# Altium schematic sheet GPS&&lte2.SchDoc
size A2
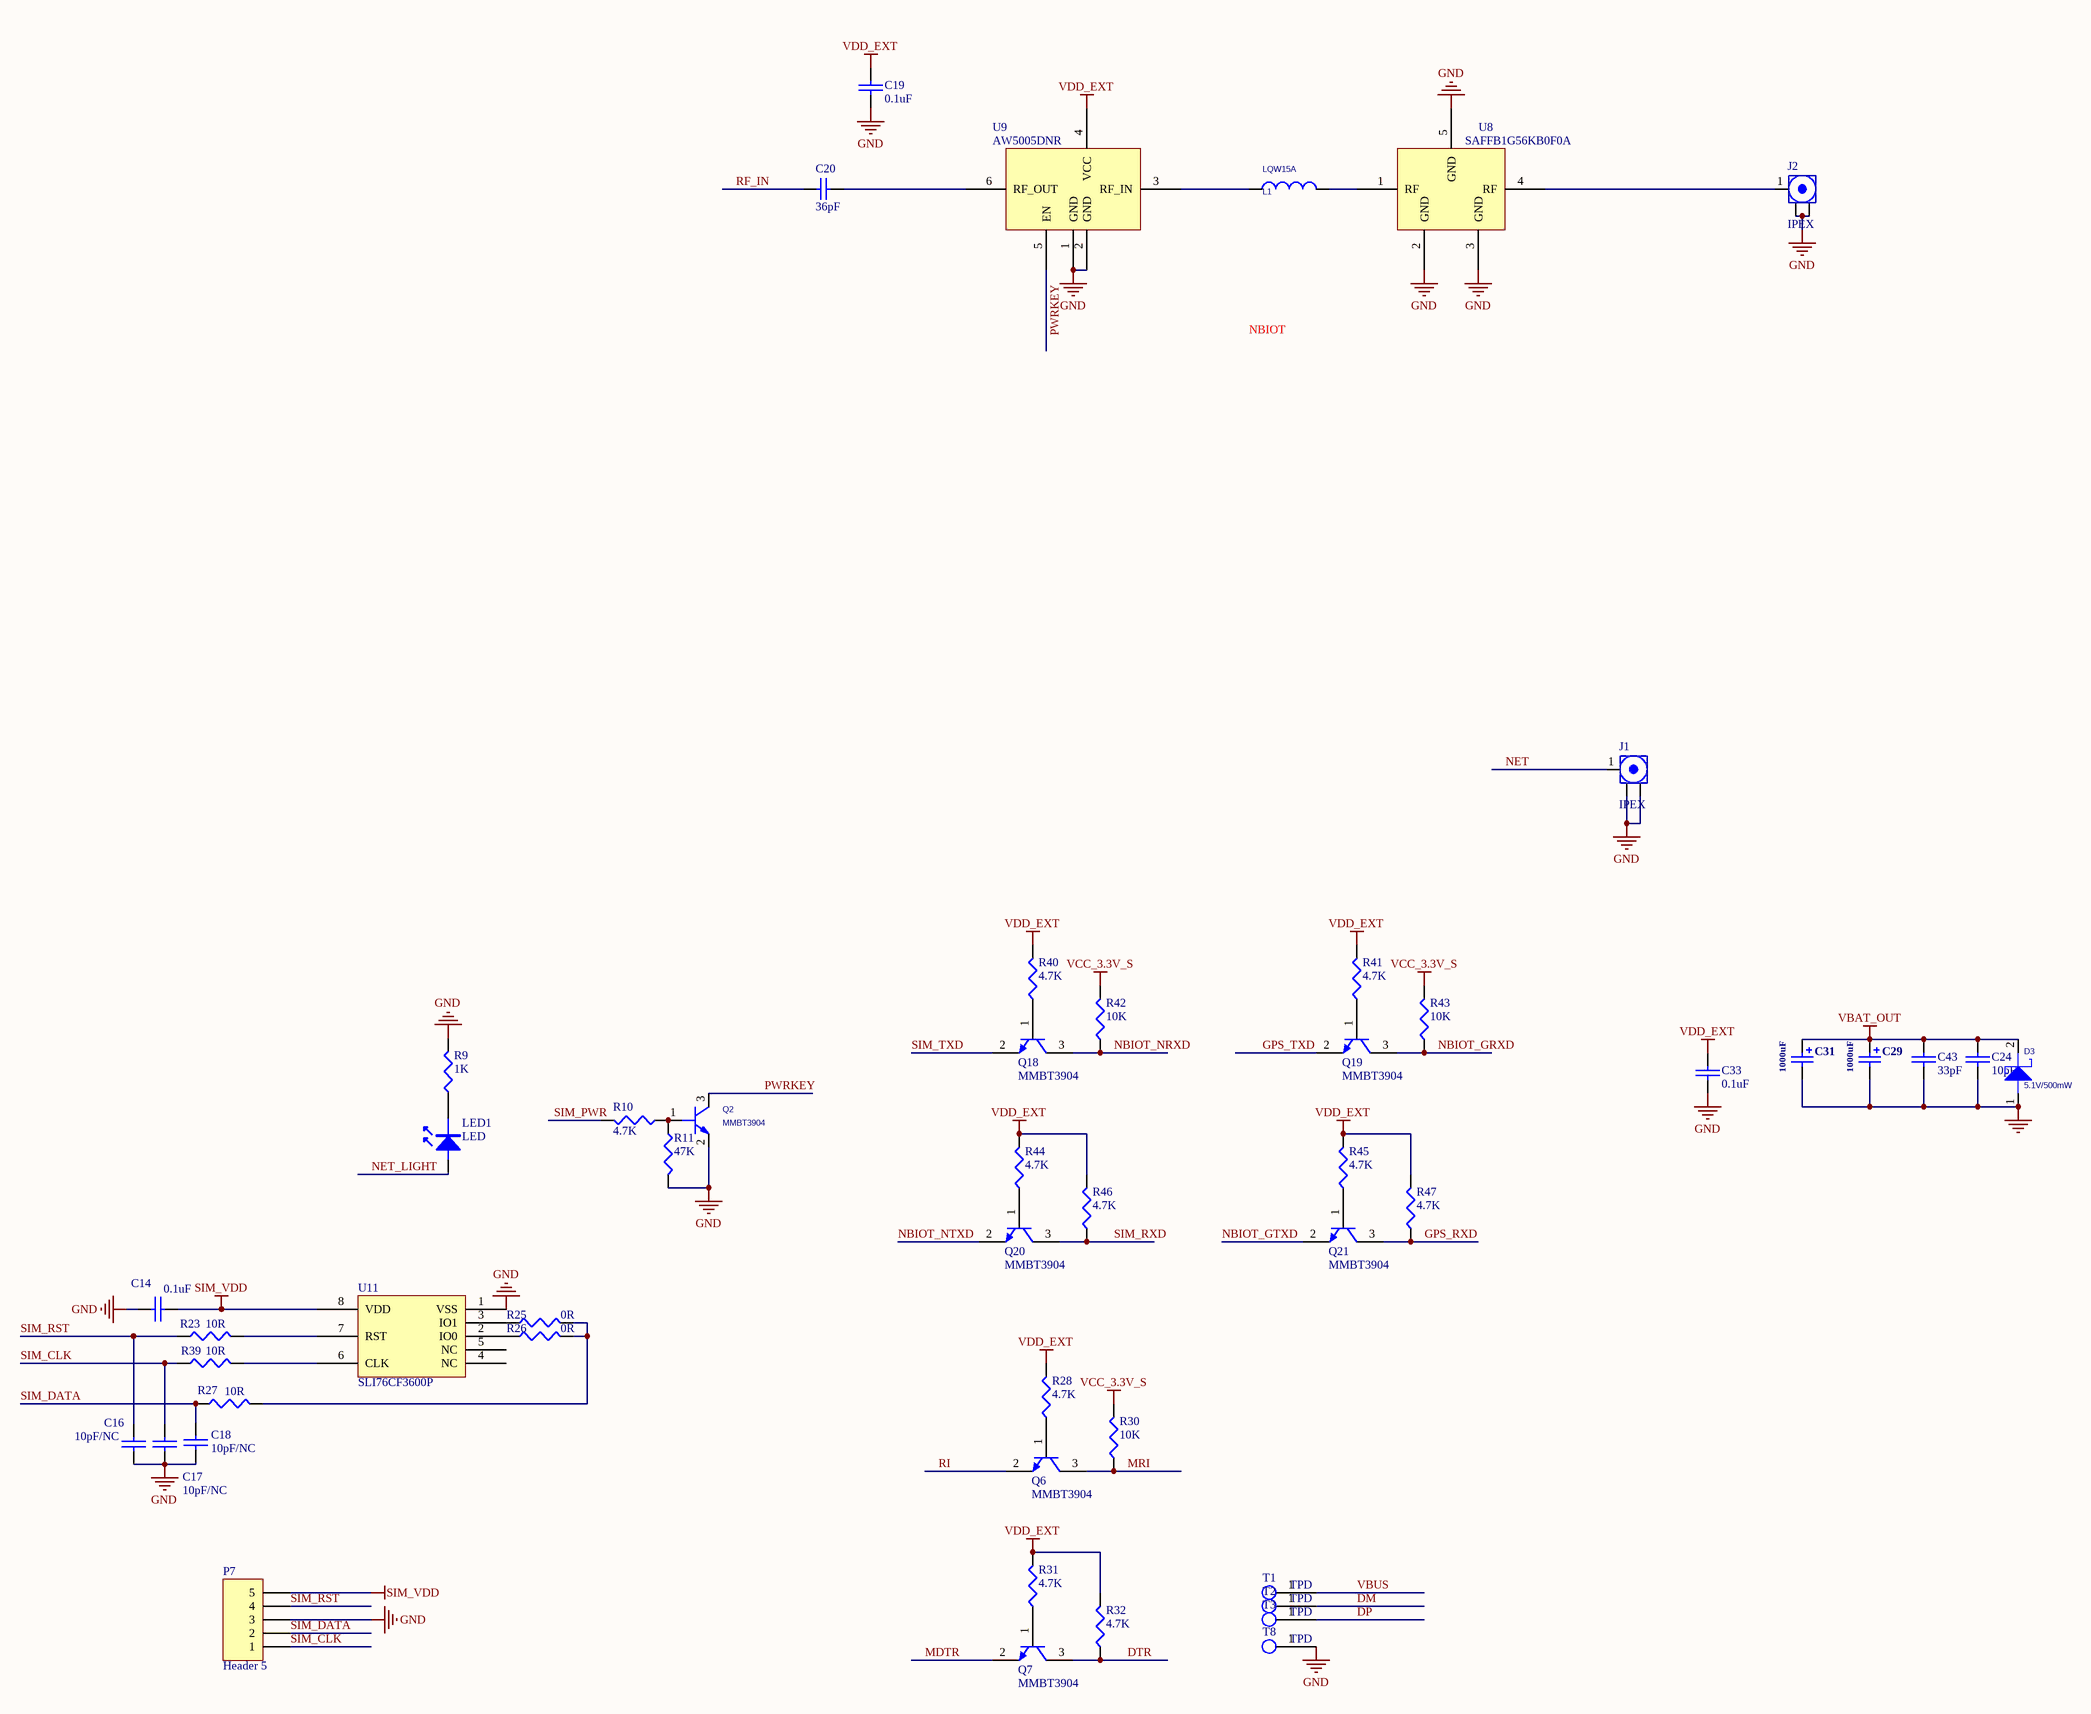
[diagram p0: GPS&&lte2.SchDoc]

## Parts
C14  0.1uF  [0402C]
C16  10pF/NC  [0402C]
C17  10pF/NC  [0402C]
C18  10pF/NC  [0402C]
C19  0.1uF  [0402C]
C20  36pF  [0402c]
C24  10pF  [0402C]
C29  1000uF  [7343]
C31  1000uF  [7343]
C33  0.1uF  [0402C]
C43  33pF  [0402C]
D3  value 5.1V/500mW  [LL-34(D1206)]  (hidden comment: DIODE_SCHOTTKY_0)
J1  IPEX  [RF-UFL]
J2  IPEX  [RF-UFL]
L1  LQW15A  [0402R]
LED1  LED  [0603LED]
P7  Header 5  [5×1.25mmSMT]
Q2  MMBT3904  [SOT23-3]
Q6  MMBT3904  [SOT23-3]
Q7  MMBT3904  [SOT23-3]
Q18  MMBT3904  [SOT23-3]
Q19  MMBT3904  [SOT23-3]
Q20  MMBT3904  [SOT23-3]
Q21  MMBT3904  [SOT23-3]
R9  1K  [0402R]
R10  4.7K  [0402R]
R11  47K  [0402R]
R23  10R  [0402R]
R25  0R  [0402R]
R26  0R  [0402R]
R27  10R  [0402R]
R28  4.7K  [0402R]
R30  10K  [0402R]
R31  4.7K  [0402R]
R32  4.7K  [0402R]
R39  10R  [0402R]
R40  4.7K  [0402R]
R41  4.7K  [0402R]
R42  10K  [0402R]
R43  10K  [0402R]
R44  4.7K  [0402R]
R45  4.7K  [0402R]
R46  4.7K  [0402R]
R47  4.7K  [0402R]
T1  TPD  [TPD]
T2  TPD  [TPD]
T3  TPD  [TPD]
T8  TPD  [TPD]
U8  SAFFB1G56KB0F0A  [SAFFB1G56KB0F0A]
U9  AW5005DNR  [AW5005]
U11  SLI76CF3600P  [QFN127P500X600X80-8N]

## Nets
GND: C14.1 C16.1 C17.1 C18.1 C19.1 C24.1 C29.2 C31.2 C33.1 C43.1 D3.1 J1.2(Y) J2.2(Y) P7.3 Q2.2(E) R9.2 R11.2 T8.1 U8.2(GND) U8.3(GND) U8.5(GND) U9.1(GND) U9.2(GND) U11.1(VSS)
SIM_VDD: C14.2 P7.5 U11.8(VDD)
VBAT_OUT: C24.2 C29.1 C31.1 C43.2 D3.2
VCC_3.3V_S: R30.2 R42.2 R43.2
VDD_EXT: C19.2 C33.2 R28.2 R31.2 R32.2 R40.2 R41.2 R44.2 R45.2 R46.2 R47.2 U9.4(VCC)
DM: T2.1
DP: T3.1
DTR: Q7.3(C) R32.1
GPS_RXD: Q21.3(C) R47.1
GPS_TXD: Q19.2(E)
MDTR: Q7.2(E)
MRI: Q6.3(C) R30.1
NBIOT_GRXD: Q19.3(C) R43.1
NBIOT_GTXD: Q21.2(E)
NBIOT_NRXD: Q18.3(C) R42.1
NBIOT_NTXD: Q20.2(E)
NET: J1.1(X)
NET_LIGHT: LED1.1
PWRKEY: Q2.3(C) U9.5(EN)
RF_IN: C20.1
RI: Q6.2(E)
SIM_CLK: C17.2 P7.1 R39.1
SIM_DATA: C18.2 P7.2 R27.1
SIM_PWR: R10.2
SIM_RST: C16.2 P7.4 R23.1
SIM_RXD: Q20.3(C) R46.1
SIM_TXD: Q18.2(E)
VBUS: T1.1
NetC20_2: C20.2 U9.6(RF_OUT)
NetJ2_1: J2.1(X) U8.4(RF)
NetL1_1: L1.1 U9.3(RF_IN)
NetL1_2: L1.2 U8.1(RF)
NetLED1_2: LED1.2 R9.1
NetQ2_1: Q2.1(B) R10.1 R11.1
NetQ6_1: Q6.1(B) R28.1
NetQ7_1: Q7.1(B) R31.1
NetQ18_1: Q18.1(B) R40.1
NetQ19_1: Q19.1(B) R41.1
NetQ20_1: Q20.1(B) R44.1
NetQ21_1: Q21.1(B) R45.1
NetR23_2: R23.2 U11.7(RST)
NetR25_1: R25.1 U11.3(IO1)
NetR25_2: R25.2 R26.2 R27.2
NetR26_1: R26.1 U11.2(IO0)
NetR39_2: R39.2 U11.6(CLK)

Not connected (* = marked no-connect by the designer): U11 4(NC) 5(NC)

## Notes on the sheet
- NBIOT

## Library data of the parts
C14 C16-C19 C24 C33 C43 = CAP: Capacitor
C20 = Cap: Capacitor; Value: 0.1uF/10V; Published: 8-Jun-2000; LatestRevisionDate: 17-Jul-2002; LatestRevisionNote: Re-released for DXP Platform.; PackageReference: RAD-0.3; Publisher: Altium Limited
C29 C31 = Cap Pol3: Polarized Capacitor (Surface Mount); PackageReference: C10*10.2
D3 = DIODE_SCHOTTKY_0: PCB DECAL: DO_214AC; Source_Path: E:\AIH\WORK\A\LIBRARY1.OLB
J1 J2 = ANT
L1 = INDUCTOR_1
P7 = Header 5: Header, 5-Pin; LatestRevisionDate: 17-Jul-2002; LatestRevisionNote: Re-released for DXP Platform.; Publisher: Altium Limited
Q2 = 2N1069_1: PspiceTemplate: Q^@REFDES %C %B %E
Q6 Q7 Q18-Q21 = NPN
R9-R11 R23 R25-R28 R30-R32 R39-R47 = RES1: P: 1/8W
U8 = SAFFB1G56KBOFA